# EAGLE design apic (EAGLE 8.3.1)
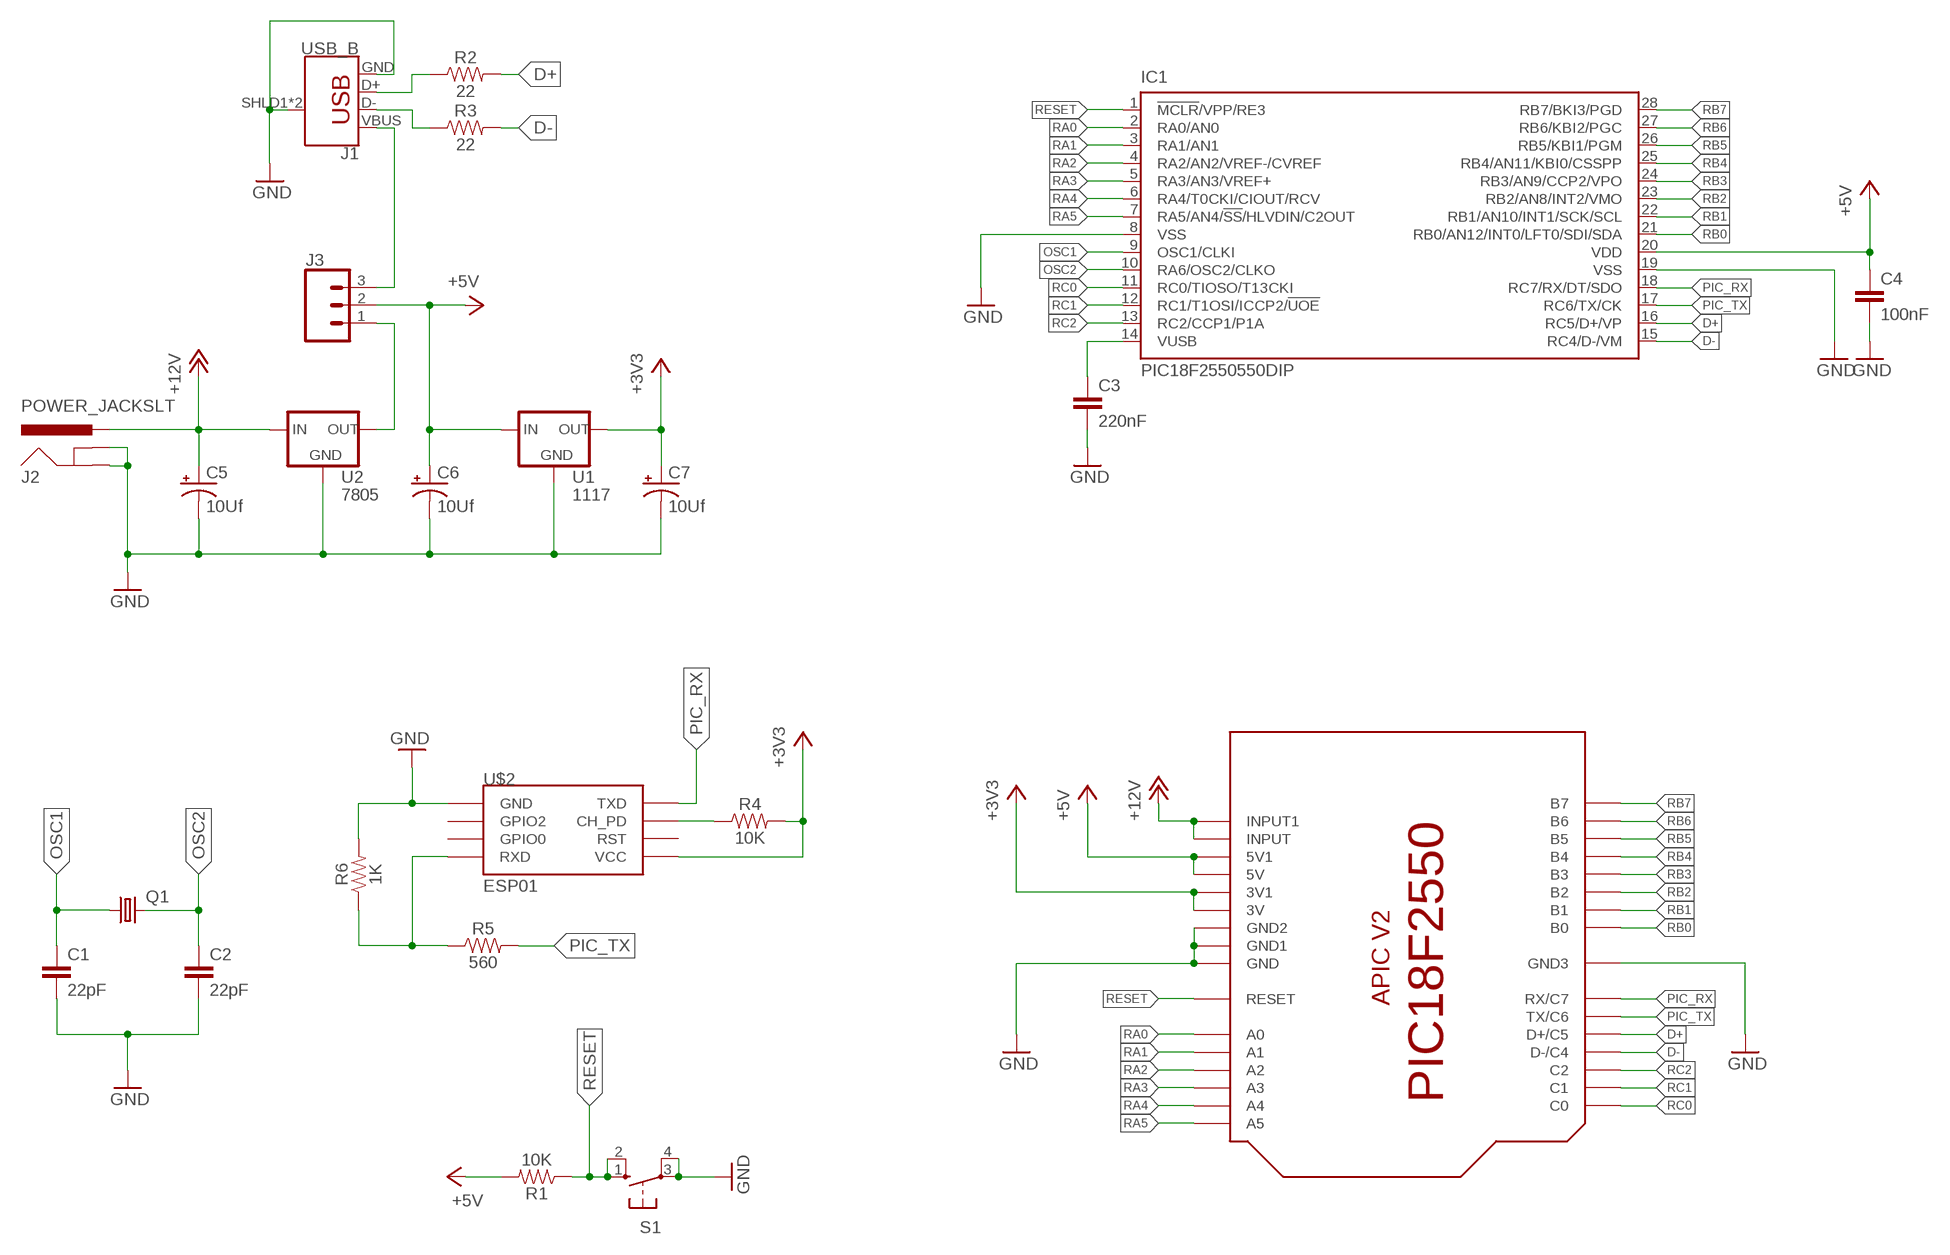
[diagram p0: schematic, sheet 1]

## Parts
C1  22pF  CAP-PTH-SMALL-KIT  [CAP-PTH-SMALL-KIT]
C2  22pF  CAP-PTH-SMALL-KIT  [CAP-PTH-SMALL-KIT]
C3  220nF  CAP-PTH-5  [CAP-PTH-5MM]
C4  100nF  CAP-PTH-SMALL-KIT  [CAP-PTH-SMALL-KIT]
C5  10Uf  CPOL-2.5-5  [CPOL-RADIAL-2.5MM-5MM]
C6  10Uf  CPOL-2.5-5  [CPOL-RADIAL-2.5MM-5MM]
C7  10Uf  CPOL-2.5-5  [CPOL-RADIAL-2.5MM-5MM]
IC1  PIC18F2550550DIP  [SOCKET_DIL28]
J1  USB_B  [USB-B]
J2  POWER_JACKSLT  [POWER_JACK]
J3  CONN_03LONGPADS  [1X03_LONGPADS]
Q1  CRYSTAL  [CRYSTAL]
R1  10K  RESISTOR-AXIAL  [AXIAL-0.3]
R2  22  RESISTOR-AXIAL  [AXIAL-0.3]
R3  22  RESISTOR-AXIAL  [AXIAL-0.3]
R4  10K  RESISTOR-AXIAL  [AXIAL-0.3]
R5  560  RESISTOR-AXIAL  [AXIAL-0.3]
R6  1K  RESISTOR-AXIAL  [AXIAL-0.3]
S1  BUTTON  [BUTTON]
U1  1117  V_REG_1117-TO220ALT  [TO-220-ALT]
U2  7805  V_REG_7805-TO220ALT  [TO-220-ALT]
U$1  APIC-18F2550  [APIC-18F2550]
U$2  ESP01  [ESP01]

## Nets
+3V3: C7.+ R4.P$2 U1.2(OUT) U$1.3V U$1.3V1 U$2.VCC
+5V: C4.1 C6.+ IC1.20(VDD) J3.2 R1.P$2 U1.3(IN) U$1.5V U$1.5V1
+12V: C5.+ J2.PWR U2.1(IN) U$1.INPUT U$1.INPUT1
D+: IC1.16(RC5/D+/VP) R2.P$2 U$1.C5(D+/C5)
D-: IC1.15(RC4/D-/VM) R3.P$2 U$1.C4(D-/C4)
GND: C1.2 C2.2 C3.2 C4.2 C5.- C6.- C7.- IC1.8(VSS) IC1.19(VSS) J1.GND J1.SHLD1(SHIELD) J1.SHLD2(SHIELD) J2.GND@1(GNDBREAK) J2.GND@2(GND) R6.P$2 S1.3(P) S1.4(P1) U1.1(GND) U2.2(GND) U$1.GND U$1.GND1 U$1.GND2 U$1.GND3 U$2.GND
N$2: J1.D+ R2.P$1
N$3: J1.D- R3.P$1
N$4: C3.1 IC1.14(VUSB)
N$5: J3.1 U2.3(OUT)
N$6: J1.VBUS J3.3
N$7: R4.P$1 U$2.CH_PD
N$9: R5.P$1 R6.P$1 U$2.RX(RXD)
OSC1: C1.1 IC1.9(OSC1/CLKI) Q1.1
OSC2: C2.1 IC1.10(RA6/OSC2/CLKO) Q1.2
PIC_RX: IC1.18(RC7/RX/DT/SDO) U$1.C7(RX/C7) U$2.TX(TXD)
PIC_TX: IC1.17(RC6/TX/CK) R5.P$2 U$1.C6(TX/C6)
RA0: IC1.2(RA0/AN0) U$1.A0
RA1: IC1.3(RA1/AN1) U$1.A1
RA2: IC1.4(RA2/AN2/VREF-/CVREF) U$1.A2
RA3: IC1.5(RA3/AN3/VREF+) U$1.A3
RA4: IC1.6(RA4/T0CKI/CIOUT/RCV) U$1.A4
RA5: IC1.7(RA5/AN4/!SS!/HLVDIN/C2OUT) U$1.A5
RB0: IC1.21(RB0/AN12/INT0/LFT0/SDI/SDA) U$1.B0
RB1: IC1.22(RB1/AN10/INT1/SCK/SCL) U$1.B1
RB2: IC1.23(RB2/AN8/INT2/VMO) U$1.B2
RB3: IC1.24(RB3/AN9/CCP2/VPO) U$1.B3
RB4: IC1.25(RB4/AN11/KBI0/CSSPP) U$1.B4
RB5: IC1.26(RB5/KBI1/PGM) U$1.B5
RB6: IC1.27(RB6/KBI2/PGC) U$1.B6
RB7: IC1.28(RB7/BKI3/PGD) U$1.B7
RC0: IC1.11(RC0/TIOSO/T13CKI) U$1.C0
RC1: IC1.12(RC1/T1OSI/ICCP2/!UOE) U$1.C1
RC2: IC1.13(RC2/CCP1/P1A) U$1.C2
RESET: IC1.1(!MCLR!/VPP/RE3) R1.P$1 S1.1(S) S1.2(S1) U$1.RESET
Unconnected: U$2.GPIO0 U$2.GPIO2 U$2.RST

## Library data of the parts
C1-C4 = YAEL:CAP
C5-C7 = YAEL:CPOL
IC1 = YAEL:PIC18F2550: USB Microcontrollers with nanoWatt Technology High-Performance, Enhanced Flash, 28/40/44-Pin, Source: http://ww1.microchip.com/downloads/en/devicedoc/39632c.pdf; MF: MICROCHIP; MPN: PIC18F2550-I/SP; OC_FARNELL: 1523822; OC_NEWARK: 80K6054
J1 = YAEL:USB_B: USB Type B Connector SparkFun Products: SparkFun Stepoko <https://www.sparkfun.com/products/13899> PTH
J2 = YAEL:POWER_JACK: Power Jack Connector This is the standard 5.5mm barrel jack for power. The PTH is the most common, proven, reliable, footprint. The Slot footprint only works if the mill layer is transmitted to the PCB fab house so be warned. Here are the connectors we sell at SparkFun: DC Barrel Power Jack/Connector <https://www.sparkfun.com/products/119> (PRT-00119) DC Barrel Power Jack/Connector (SMD) <https://www.sparkfun.com/products/12748> (PRT-12748) DC Barrel Jack Adapter - Breadboard Compatible <https://www.sparkfun.com/products/10811> (PRT-10811) It is used on this SparkFun product (and many, many others): SparkFun RedBoard - Programmed with Arduino <https://www.sparkfun.com/products/12757> (DEV-12757) Also, if you need a mating power supply or connector, please check these out: Wall Adapter Power Supply - 9VDC 650mA <https://www.sparkfun.com/products/298> (TOL-00298) DC Barrel Jack Adapter - Male <https://www.sparkfun.com/products/10287> (PRT-10287); PROD_ID: PRT-00119
J3 = SparkFun-Connectors:CONN_03: Multi connection point. Often used as Generic Header-pin footprint for 0.1 inch spaced/style header connections On any of the 0.1 inch spaced packages, you can populate with these: Break Away Headers - Straight <https://www.sparkfun.com/products/116> (PRT-00116) Break Away Male Headers - Right Angle <https://www.sparkfun.com/products/553> (PRT-00553) Female Headers <https://www.sparkfun.com/products/115> (PRT-00115) Break Away Headers - Machine Pin <https://www.sparkfun.com/products/117> (PRT-00117) Break Away Female Headers - Swiss Machine Pin <https://www.sparkfun.com/products/743> (PRT-00743) Stackable Header - 3 Pin (Female, 0.1") <https://www.sparkfun.com/products/13875> (PRT-13875) For SCREWTERMINALS and SPRING TERMINALS visit here: Screw Terimnals on SparkFun.com <https://www.sparkfun.com/search/results?term=Screw+Terminals> (5mm/3.5mm/2.54mm spacing) This device is also useful as a general connection point to wire up your design to another part of your project. Our various solder wires solder well into these plated through hole pads. Hook-Up Wire - Assortment (Stranded, 22 AWG) <https://www.sparkfun.com/products/11375> (PRT-11375) Hook-Up Wire - Assortment (Solid Core, 22 AWG) <https://www.sparkfun.com/products/11367> (PRT-11367) View the entire wire category on our website here <https://www.sparkfun.com/categories/141> Special notes: Molex polarized connector foot print use with SKU : PRT-08232 with associated crimp pins and housings.
Q1 = YAEL:CRYSTAL
R1-R6 = YAEL:RESISTOR: Generic Resistor Package
S1 = YAEL:BUTTON: BUTTON; MPN: B3F-1000; OC_FARNELL: 176432; OC_NEWARK: 36M3542
U1 = YAEL:V_REG_1117: LD1117VXX voltage regulator. We carry the 3.3V version (COM-00526) in TO-220 package.
U2 = YAEL:V_REG_7805: Voltage Regulator Standard 78xx regulator. IGO (Input Ground Output). Spark Fun Electronics SKU : COM-00107
U$1 = YAEL:APIC-18F2550
U$2 = YAEL:ESP01: ESP8266 Wifi module 01

## Board
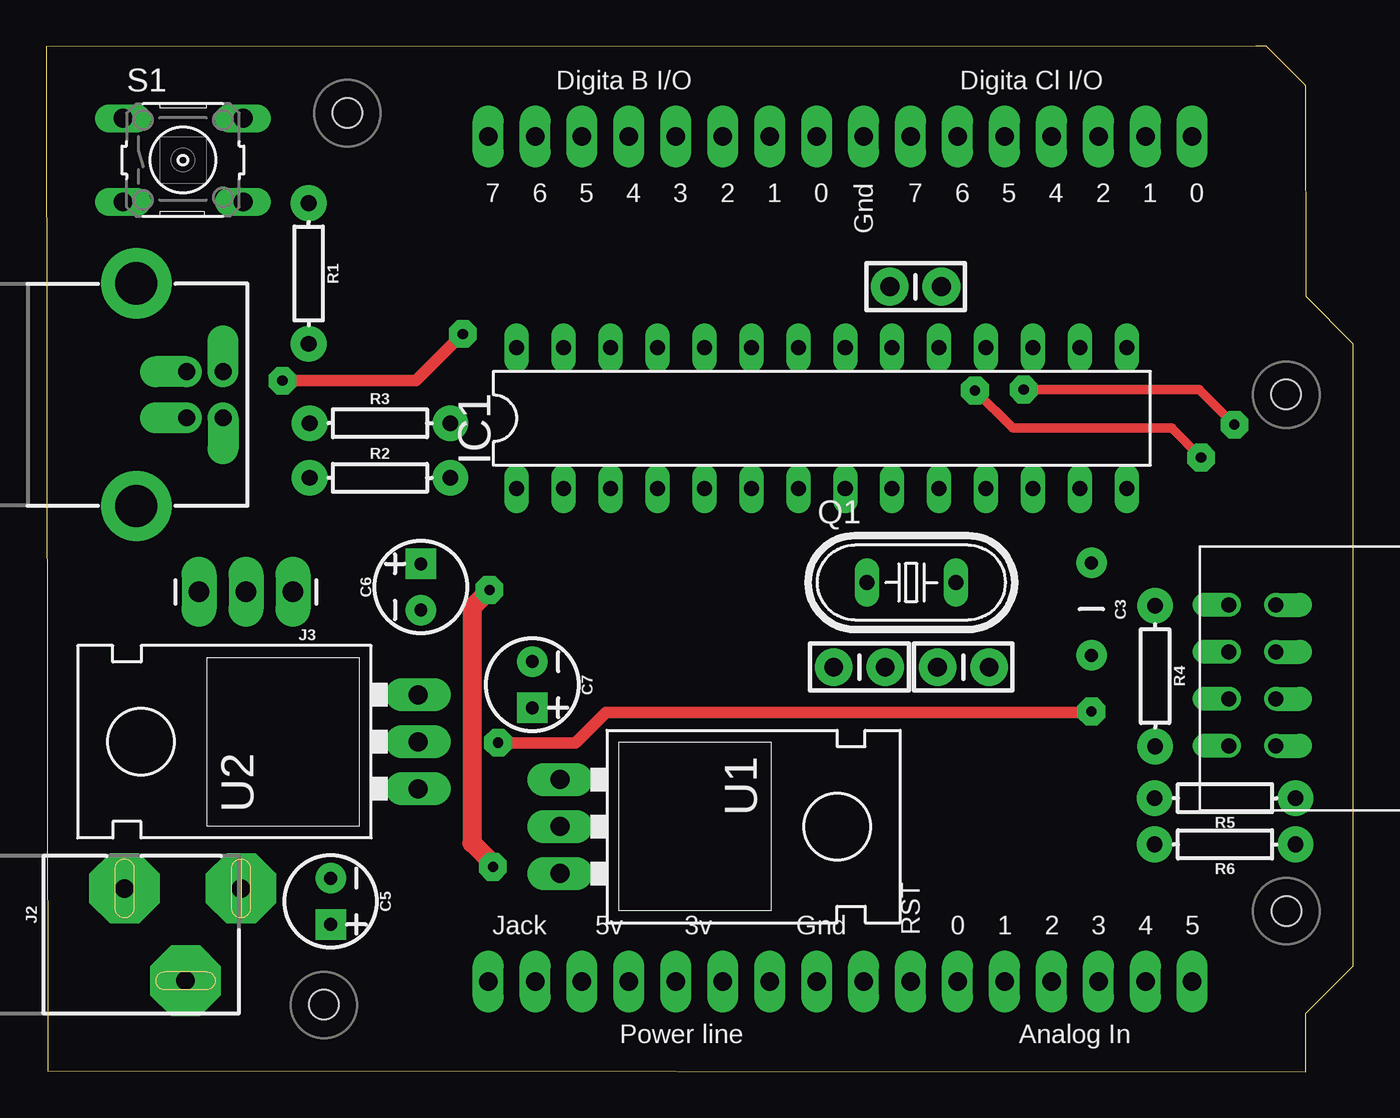
[diagram p1: board, top side]
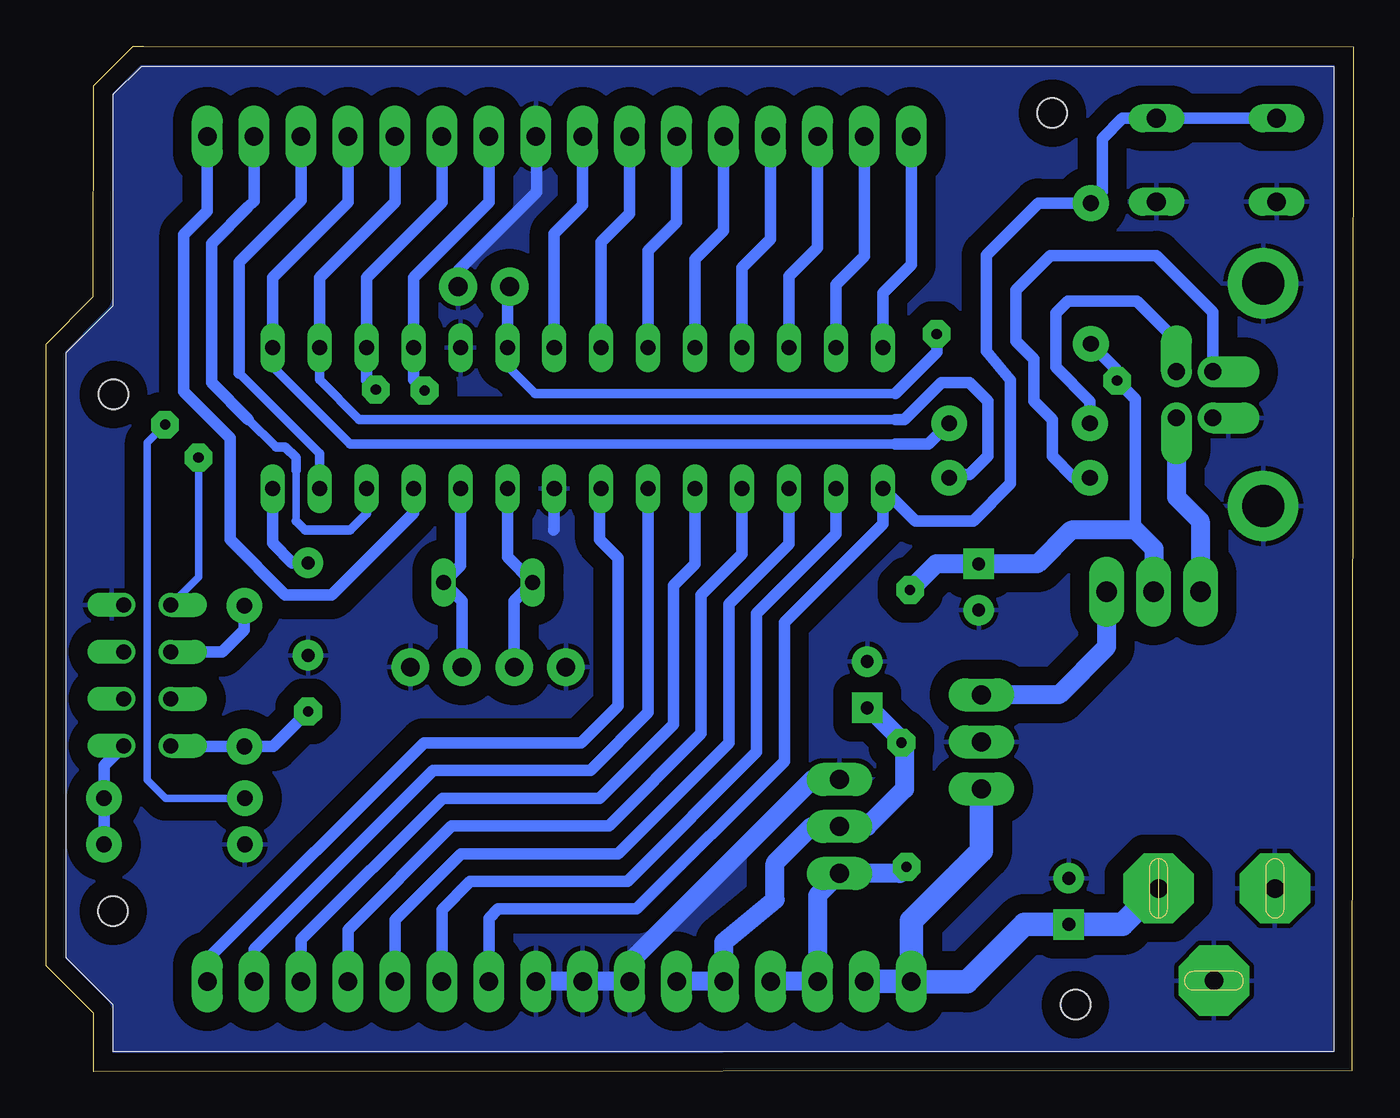
[diagram p2: board, bottom side, seen from below]

Size 70.72 x 55.49 mm. Coordinates in mm from the lower left corner, seen from the top.
Outline: 0.09,0.05 68.15,0 68.14,3.15 70.71,5.72 70.72,39.37 68.17,41.93 68.16,53.36 66.01,55.49 65.45,55.49 0,55.47 0.09,0.05
Copper layers (1*16): Top 0.035mm / dielectric 1.5mm / Bottom 0.035mm
Design rules "default": minimum track width 6mil, minimum drill 0.35mm, track to track 6mil, track to pad 6mil, pad to pad 6mil, via to via 6mil, smd to smd 6mil, copper to edge 40mil, drill to drill 6mil, minimum pad ring 10mil, minimum via ring 8mil, stop-mask expansion 4mil, vias tented up to drill 0mil, thermal gap 10mil
Holes 1.6 mm at 67.08,36.65 67.1,8.7 15.03,3.62 16.28,51.87

### Footprints (pad centres in the part's own frame; a part is rotated, then mirrored left to right if it is on the bottom)
CAP-PTH-SMALL-KIT = drill 1.016 pad 2.032: 1 -1.397,0; 2 1.397,0
CAP-PTH-5MM = drill 0.7 pad 1.651: 1 -2.5,0; 2 2.5,0
CPOL-RADIAL-2.5MM-5MM = drill 0.7 pad 1.651 square: + 1.25,0 | drill 0.7 pad 1.651: - -1.25,0
SOCKET_DIL28 = drill 0.813 long: 1 -16.51,-3.81; 2 -13.97,-3.81; 3 -11.43,-3.81; 4 -8.89,-3.81; 5 -6.35,-3.81; 6 -3.81,-3.81; 7 -1.27,-3.81; 8 1.27,-3.81; 9 3.81,-3.81; 10 6.35,-3.81; 11 8.89,-3.81; 12 11.43,-3.81; 13 13.97,-3.81; 14 16.51,-3.81; 15 16.51,3.81; 16 13.97,3.81; 17 11.43,3.81; 18 8.89,3.81; 19 6.35,3.81; 20 3.81,3.81; 21 1.27,3.81; 22 -1.27,3.81; 23 -3.81,3.81; 24 -6.35,3.81; 25 -8.89,3.81; 26 -11.43,3.81; 27 -13.97,3.81; 28 -16.51,3.81
USB-B = drill 0.914 pad 1.676 offset: D+ 4,1.25; D- 5.981,1.25; GND 4,-1.25; VBUS 5.981,-1.25 | drill 2.286 pad 3.81: SHLD1 1.282,-6.02; SHLD2 1.282,6.02
POWER_JACK = drill 1 pad 3.81 octagon: GND@1 2.58,7.5; GND@2 7.58,10.8; PWR 2.58,13.8
1X03_LONGPADS = drill 1.118 pad 1.88 long: 1 0,0; 2 2.54,0; 3 5.08,0
CRYSTAL = drill 0.813 long: 1 -2.413,0; 2 2.413,0
AXIAL-0.3 = drill 0.85 pad 1.93: P$1 -3.81,0; P$2 3.81,0
BUTTON = drill 1.016 long: 1 -3.251,2.261; 2 3.251,2.261; 3 -3.251,-2.261; 4 3.251,-2.261
TO-220-ALT = drill 1.016 pad 1.778 long: 1 -2.54,-3.81; 2 0,-3.81; 3 2.54,-3.81
APIC-18F2550 = drill 1 pad 1.676 long: 3V 35.56,3.81; 3V1 33.02,3.81; 5V 30.48,3.81; 5V1 27.94,3.81; A0 48.26,3.81; A1 50.8,3.81; A2 53.34,3.81; A3 55.88,3.81; A4 58.42,3.81; A5 60.96,3.81; B0 40.64,49.53; B1 38.1,49.53; B2 35.56,49.53; B3 33.02,49.53; B4 30.48,49.53; B5 27.94,49.53; B6 25.4,49.53; B7 22.86,49.53; C0 60.96,49.53; C1 58.42,49.53; C2 55.88,49.53; C4 53.34,49.53; C5 50.8,49.53; C6 48.26,49.53; C7 45.72,49.53; GND 43.18,3.81; GND1 40.64,3.81; GND2 38.1,3.81; GND3 43.18,49.53; INPUT 25.4,3.81; INPUT1 22.86,3.81; RESET 45.72,3.81
ESP01 = drill 0.8 offset: CH_PD -1.285,-8.178; GND -3.825,-5.638; GPIO0 1.255,-5.638; GPIO2 -1.285,-5.638; RST 1.255,-8.178; RX 3.795,-5.638; TX -3.825,-8.178; VCC 3.795,-8.178

### Placement (x,y rotation side)
C1  44,21.89 180 top
C2  49.62,21.89 0 top
C3  56.55,25.03 270 top
C4  47.04,42.48 0 top
C5  15.39,9.22 270 top
C6  20.27,26.23 90 top
C7  26.3,20.94 270 top
IC1  41.96,35.36 0 top
J1  3.59,36.63 0 top
J2  -3.26,12.5 270 top
J3  13.35,25.97 180 top
Q1  46.81,26.47 0 top
R1  14.2,43.19 270 top
R2  18.06,32.13 0 top
R3  18.06,35.09 0 top
R4  60,21.41 270 top
R5  63.78,14.8 180 top
R6  63.78,12.3 180 top
S1  7.4,49.33 0 top
U1  31.61,13.27 270 top
U2  16.31,17.85 90 top
U$1  1.05,1.07 0 top
U$2  72.17,21.43 270 top

### Tracks (layer width: path | path; a pad name or v marks a point on that pad's centre or on a via)
+3V3  (via drill 0.55 pad 1.5)
  Top 0.61: v24.45,17.8 28.65,17.8 30.28,19.43 56.49,19.43 v56.55,19.49
  Bottom 0.61: U$2.VCC 63.96,17.6 R4.P$2 58.44,17.6 v56.55,19.49 | v24.45,17.8 24.28,17.8
  Bottom 1.016: U$1.3V U$1.3V1 34.07,7.01 31.28,9.3 31.28,11.3 29.31,13.27 U1.2 26.31,13.27 24.28,15.3 24.28,17.8 26.17,19.69 C7.+
+5V  (via drill 0.55 pad 1.5)
  Top 0.61: v22.54,39.92 20.01,37.39 v12.78,37.39
  Top 1.016: v23.98,26.07 23.04,25.13 23.04,12.37 24.17,11.24 v24.17,11.09
  Bottom 0.508: 45.77,38.29 IC1.20 45.77,38.18 44.28,36.69 24.78,36.69
  Bottom 0.61: C4.1 45.77,42.35 IC1.20 | 24.78,36.69 22.54,38.93 v22.54,39.92 | R1.P$2 12.78,37.96 v12.78,37.39 11.78,36.39 11.78,29.3
  Bottom 1.016: U$1.5V U$1.5V1 28.99,9.54 U1.3 24.53,10.73 v24.17,11.09 | v23.98,26.07 22.57,27.48 C6.+ 17.1,27.48 15.28,29.3 11.78,29.3 10.78,28.3 10.78,26 J3.2
+12V
  Bottom 1.27: U$1.INPUT1 U$1.INPUT | U2.1 20.12,11.96 23.91,8.17 U$1.INPUT1 | U$1.INPUT1 23.89,4.86 20.9,4.86 17.79,7.97 C5.+ 12.49,7.97 J2.PWR
D+
  Bottom 0.508: 24.78,35.3 53.78,35.3 55.93,37.45 IC1.16
  Bottom 0.61: IC1.16 55.93,42.98 51.85,47.06 U$1.C5 | 24.78,35.3 24.28,35.3 22.28,37.3 20.78,37.3 19.78,36.3 19.78,33.3 20.78,32.3 21.7,32.3 R2.P$2
D-
  Bottom 0.508: 24.78,33.97 54.28,33.97 58.47,38.16 IC1.15
  Bottom 0.61: IC1.15 58.47,42.98 54.39,47.06 U$1.C4 | 24.78,33.97 22.99,33.97 R3.P$2
GND
  Bottom 0.61: IC1.8 43.23,29.35 43.28,29.3 | C4.2 48.44,43.34 44.19,47.59 44.19,50.56 U$1.GND3
  Bottom 1.016: 27.78,15.83 U1.1 29.27,15.81 39.15,5.93 U$1.GND2 U$1.GND1 U$1.GND
  pour Bottom (isolate 1.016): -1.84,-1.5 -1.76,56.83 74.88,56.67 74.8,-1.66
N$2
  Bottom 0.61: J1.D+ 7.59,41.11 10.65,44.17 16.38,44.17 18.26,42.29 18.26,39.53 17.28,38.55 17.28,36.3 16.28,35.3 16.28,33.3 15.11,32.13 R2.P$1
N$3
  Bottom 0.61: J1.D- 9.57,39.57 11.71,41.71 15.44,41.71 16.1,41.05 16.1,38.12 14.25,36.27 R3.P$1
N$4
  Bottom 0.61: IC1.14 58.47,28.6 57.4,27.53 C3.1
N$5
  Bottom 1.016: J3.1 13.35,22.99 15.94,20.4 U2.3
N$6
  Bottom 1.016: J1.VBUS 9.57,31.09 8.28,29.8 J3.3
N$7
  Bottom 0.61: R4.P$1 60,23.9 61.2,22.7 63.98,22.7 U$2.CH_PD
N$9
  Bottom 0.61: U$2.RX 67.59,16.58 R5.P$1 R6.P$1
OSC1
  Bottom 0.61: IC1.9 45.77,27.84 Q1.1 45.4,25.47 C1.1
OSC2
  Bottom 0.61: IC1.10 48.31,27.38 Q1.2 48.22,25.47 C2.1
PIC_RX  (via drill 0.55 pad 1.5)
  Top 0.508: v62.48,33.23 60.89,34.82 52.29,34.82 v50.25,36.86
  Bottom 0.406: U$2.TX 62.48,26.77 v62.48,33.23
  Bottom 0.61: v50.25,36.86 50.85,37.46 IC1.18 50.85,42.98 46.77,47.06 U$1.C7
PIC_TX  (via drill 0.55 pad 1.5)
  Top 0.508: v64.29,35.01 62.39,36.91 v52.88,36.91
  Bottom 0.305: 65.26,27.17 65.25,27.16
  Bottom 0.406: R5.P$2 64.26,14.8 65.25,15.79 65.25,27.16 65.25,34.05 v64.29,35.01
  Bottom 0.61: v52.88,36.91 53.39,37.42 IC1.17 53.39,42.98 49.31,47.06 U$1.C6
RA0
  Bottom 0.61: U$1.A0 49.31,8.77 47.78,10.3 39.28,10.3 32.28,17.3 32.28,24.8 27.99,29.09 IC1.2
RA1
  Bottom 0.61: U$1.A1 51.85,8.23 48.28,11.8 39.78,11.8 33.78,17.8 33.78,25.3 30.53,28.55 IC1.3
RA2
  Bottom 0.61: U$1.A2 54.39,7.69 48.78,13.3 40.28,13.3 35.28,18.3 35.28,25.8 33.07,28.01 IC1.4
RA3
  Bottom 0.61: U$1.A3 56.93,7.15 49.28,14.8 40.78,14.8 36.78,18.8 36.78,26.3 35.61,27.47 IC1.5
RA4
  Bottom 0.61: U$1.A4 59.47,6.61 49.78,16.3 41.28,16.3 38.15,19.43 IC1.6
RA5
  Bottom 0.61: IC1.7 40.78,31.46 40.78,28.8 39.78,27.8 39.78,19.8 41.78,17.8 50.28,17.8 62.01,6.07 U$1.A5
RB0
  Bottom 0.61: IC1.21 43.23,45.35 41.69,46.89 U$1.B0
RB1
  Bottom 0.61: IC1.22 40.69,44.89 39.15,46.43 U$1.B1
RB2
  Bottom 0.61: IC1.23 38.15,44.43 36.61,45.97 U$1.B2
RB3
  Bottom 0.61: IC1.24 35.61,43.97 34.07,45.51 U$1.B3
RB4
  Bottom 0.61: IC1.25 33.07,43.51 31.53,45.05 U$1.B4
RB5
  Bottom 0.61: IC1.26 30.53,43.05 28.99,44.59 U$1.B5
RB6
  Bottom 0.61: IC1.27 27.99,42.59 26.45,44.13 U$1.B6
RB7
  Bottom 0.61: IC1.28 25.45,42.13 23.91,43.67 U$1.B7
RC0
  Bottom 0.508: IC1.11 50.85,30.23
  Bottom 0.61: 50.85,30.23 55.28,25.8 57.78,25.8 60.78,28.8 60.78,34.3 63.28,36.8 63.28,45.3 62.28,46.3 | 62.28,46.3 62.01,46.57 | 62.28,46.3 62.01,46.57 | 62.01,46.57 U$1.C0
RC1
  Bottom 0.406: 57.2,32.53 57.2,29.8
  Bottom 0.508: IC1.12 53.39,30.19 54.28,29.3 56.7,29.3 57.2,29.8 | 59.78,35.3 58.28,33.8 57.78,33.8 57.2,33.22 57.2,32.53
  Bottom 0.61: 59.78,35.3 61.78,37.3 61.78,44.8 59.78,46.8 | 59.78,46.8 59.47,47.11 | 59.78,46.8 59.47,47.11 | 59.47,47.11 U$1.C1
RC2
  Bottom 0.508: 60.28,37.8 55.93,33.45 IC1.13
  Bottom 0.61: 60.28,37.8 60.28,43.8 57.03,47.05 | 57.03,47.05 56.93,47.15 | 57.03,47.05 56.93,47.15 | 56.93,47.15 U$1.C2
RESET
  Bottom 0.61: U$1.RESET 46.77,8.31 46.28,8.8 38.78,8.8 30.78,16.8 30.78,24.3 25.45,29.63 IC1.1 23.7,29.8 20.56,29.8 18.54,31.82 18.54,37.43 19.86,38.99 19.86,44.19 17.05,47 R1.P$1 13.59,47.61 13.59,50.49 12.49,51.59 S1.2 S1.1